# EAGLE design JTAG (EAGLE 7.5.0)
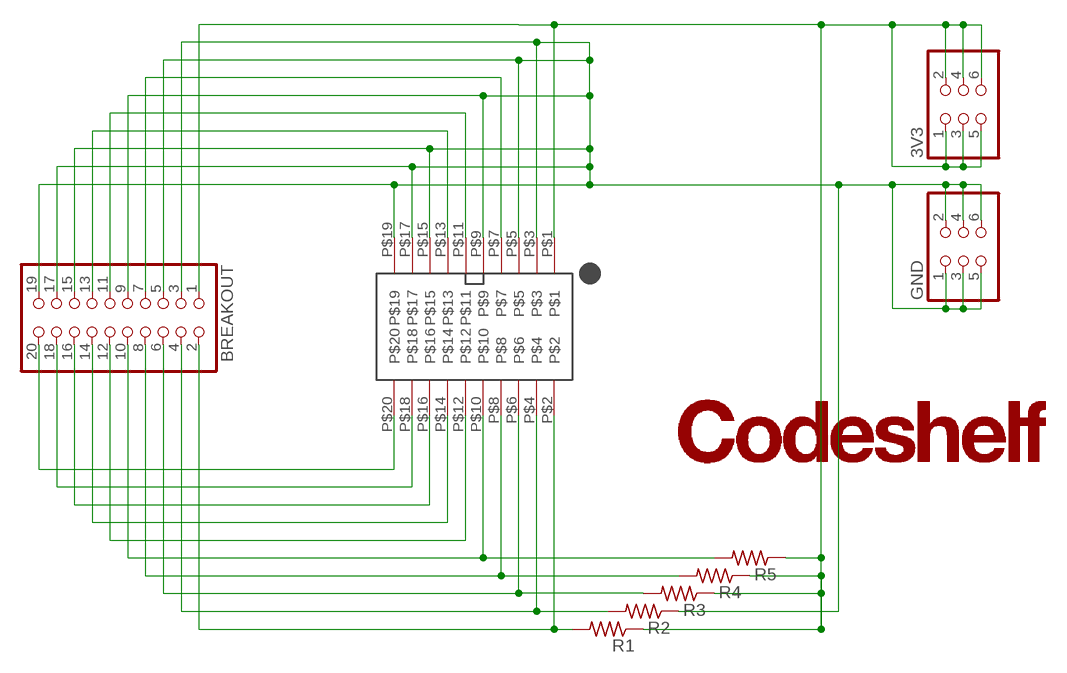
[diagram p0: schematic, sheet 1]

## Parts
3V3  PINHD-2X3  [2X03]
BREAKOUT  PINHD-2X10  [2X10]
GND  PINHD-2X3  [2X03]
JTAG  2X10JTAG  [2X10JTAG]
R1  R-US_0207/10  [0207/10]
R2  R-US_0207/10  [0207/10]
R3  R-US_0207/10  [0207/10]
R4  R-US_0207/10  [0207/10]
R5  R-US_0207/10  [0207/10]
U$1  CODESHELF-LOGOSMALL  [CODESHELF-LOGO-SMALL]

## Nets
3V3: 3V3.1 3V3.2 3V3.3 3V3.4 3V3.5 3V3.6 BREAKOUT.1 JTAG.P$1 R1.1 R3.1 R4.1 R5.1
GND: BREAKOUT.3 BREAKOUT.5 BREAKOUT.9 BREAKOUT.15 BREAKOUT.17 BREAKOUT.19 GND.1 GND.2 GND.3 GND.4 GND.5 GND.6 JTAG.P$3 JTAG.P$5 JTAG.P$9 JTAG.P$15 JTAG.P$17 JTAG.P$19 R2.1
N$2: BREAKOUT.2 JTAG.P$2 R1.2
N$3: BREAKOUT.4 JTAG.P$4 R2.2
N$4: BREAKOUT.6 JTAG.P$6 R3.2
N$5: BREAKOUT.8 JTAG.P$8 R4.2
N$6: BREAKOUT.10 JTAG.P$10 R5.2
N$7: BREAKOUT.12 JTAG.P$12
N$8: BREAKOUT.14 JTAG.P$14
N$9: BREAKOUT.16 JTAG.P$16
N$10: BREAKOUT.18 JTAG.P$18
N$11: BREAKOUT.20 JTAG.P$20
N$14: BREAKOUT.7 JTAG.P$7
N$16: BREAKOUT.11 JTAG.P$11
N$27: BREAKOUT.13 JTAG.P$13

## Library data of the parts
3V3 GND = pinhead:PINHD-2X3: PIN HEADER
BREAKOUT = pinhead:PINHD-2X10: PIN HEADER
JTAG = KW2:2X10JTAG; MFGN: CNC Tech; MFGP: 3220-20-0100-00
R1-R5 = resistor:R-US_: RESISTOR, American symbol
U$1 = GW-devices:CODESHELF-LOGO

## Board
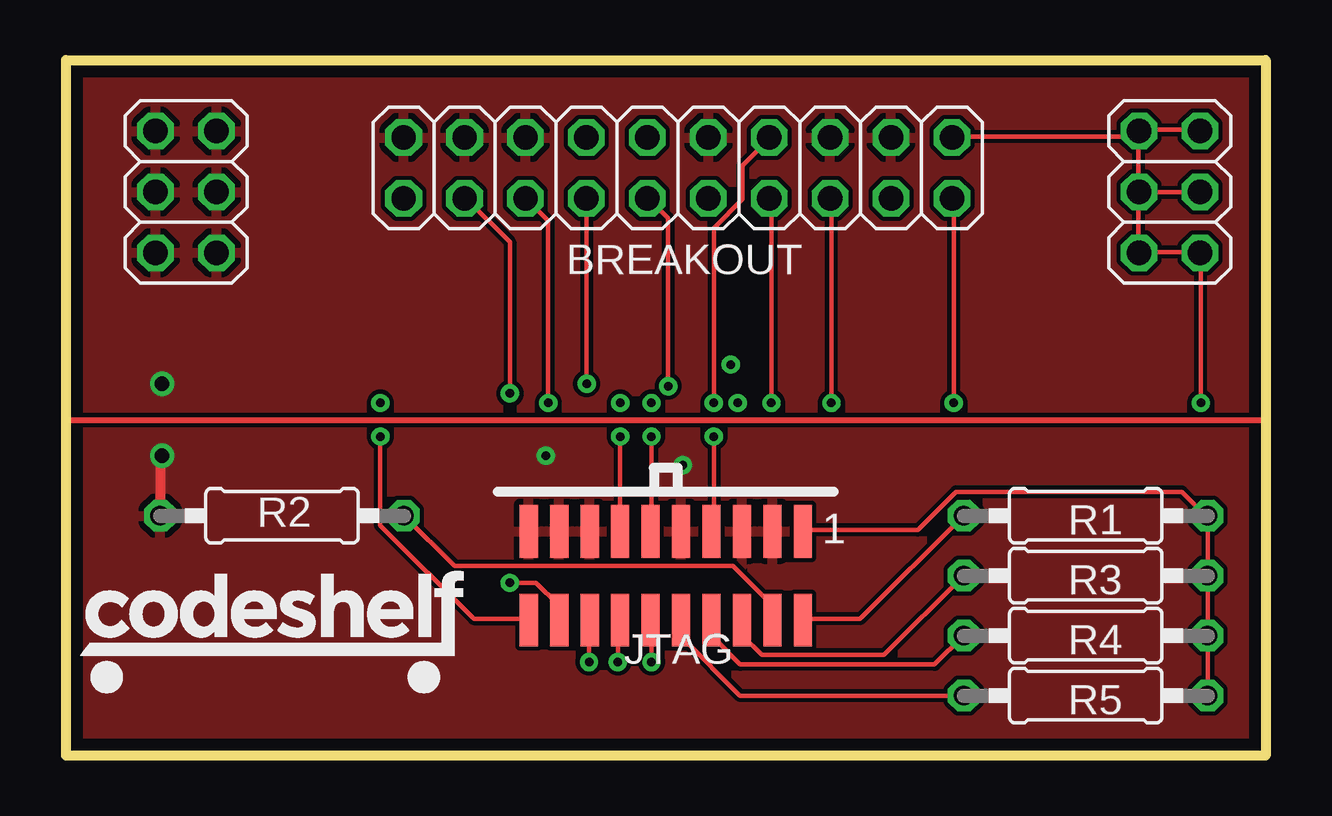
[diagram p1: board, top side]
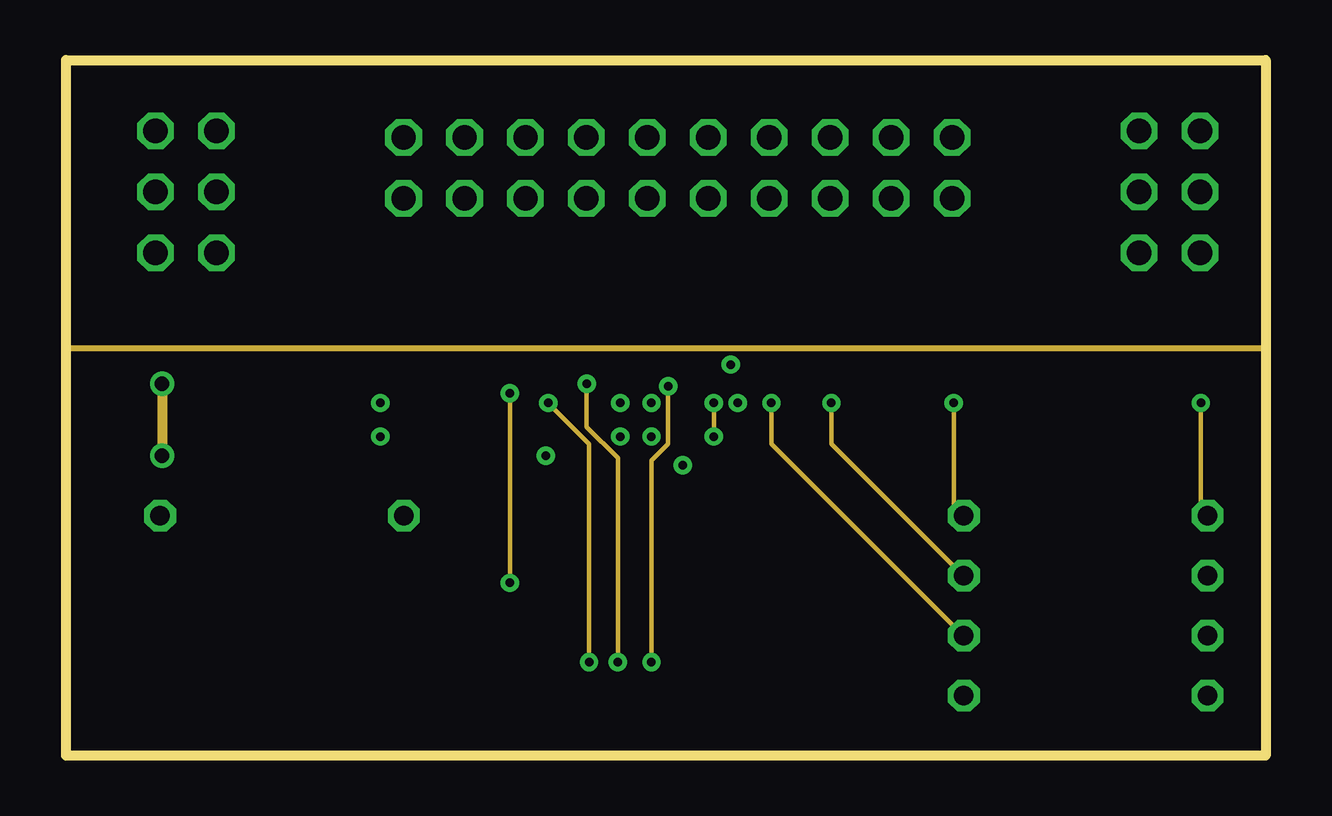
[diagram p2: board, inner layer Route2]
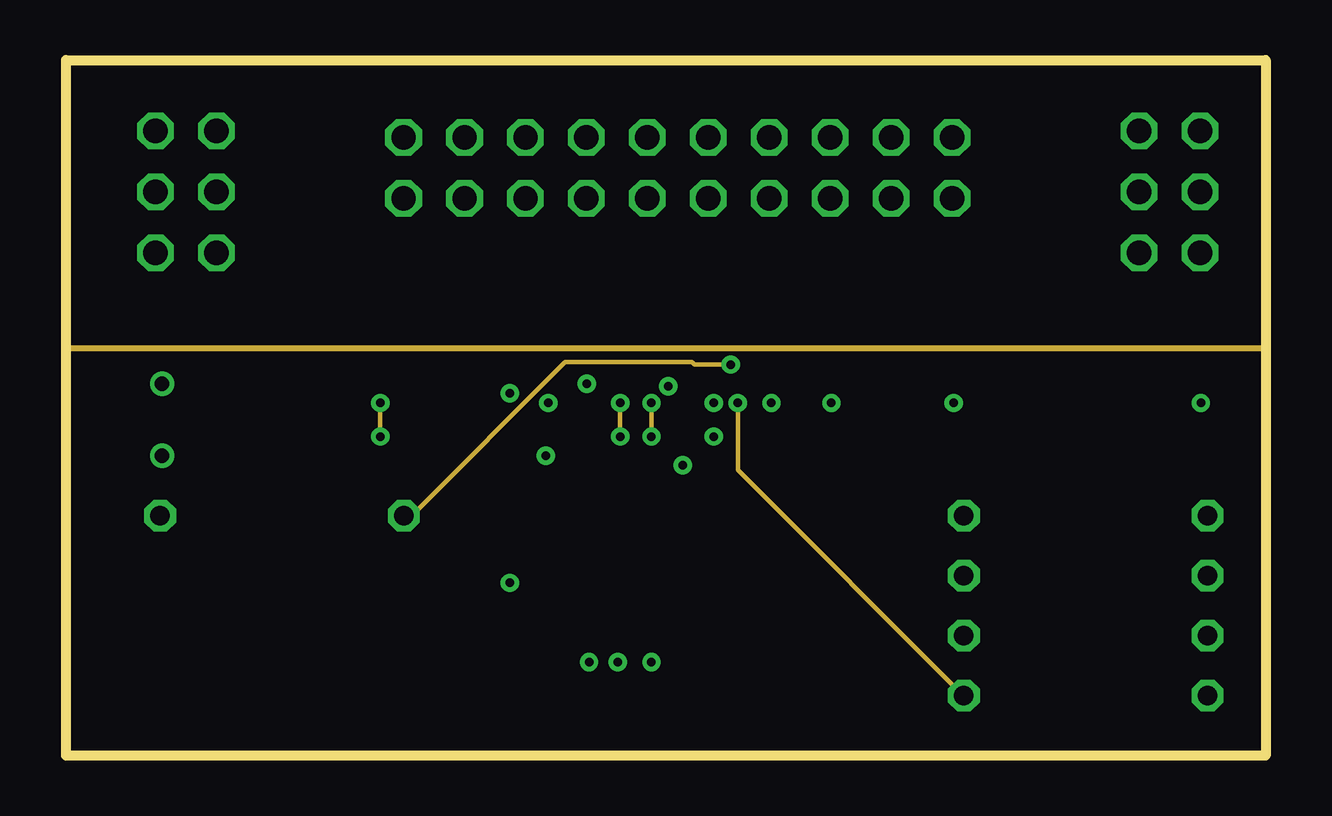
[diagram p3: board, inner layer Route15]
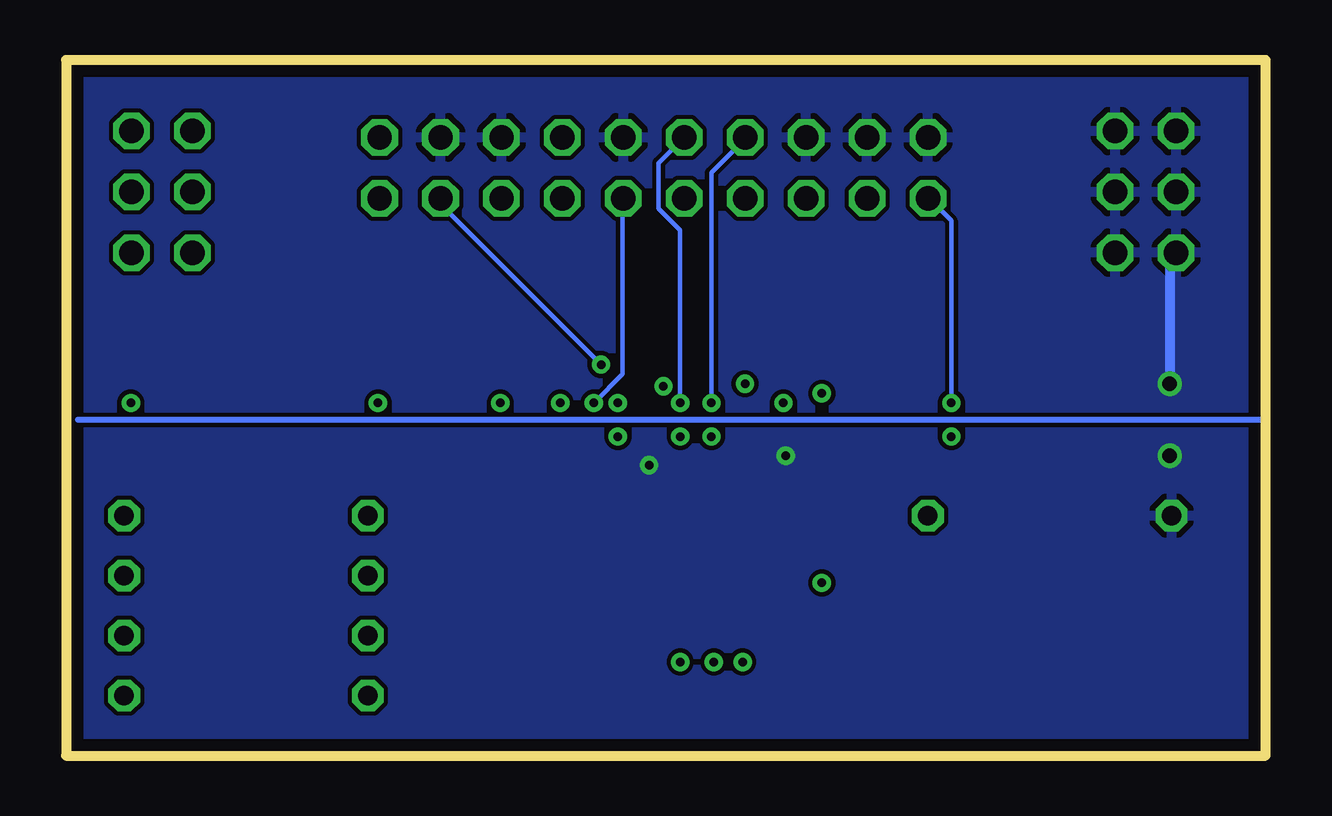
[diagram p4: board, bottom side, seen from below]

Size 50 x 29 mm. Coordinates in mm from the lower left corner, seen from the top.
Outline: 0,0 50,0
Outline: 50,0 50,29
Outline: 50,29 0,29
Outline: 0,29 0,0
Outline: 0,0 0,29
Outline: 0,29 50,29
Outline: 50,29 50,0
Outline: 50,0 0,0
Copper layers (1*2*15*16): Top 0.0356mm / dielectric 1.5011mm / Route2 0.0356mm / dielectric 0.1499mm / Route15 0.0356mm / dielectric 0.2007mm / Bottom 0.0356mm
Design rules "Codeshelf_Standard *": minimum track width 7mil, minimum drill 14mil, track to track 7mil, track to pad 7mil, pad to pad 7mil, via to via 7mil, smd to smd 0mil, copper to edge 20mil, drill to drill 8mil, minimum pad ring 10mil, minimum via ring 8mil, stop-mask expansion 4mil, vias tented up to drill 0mil, thermal gap 10mil

### Footprints (pad centres in the part's own frame; a part is rotated, then mirrored left to right if it is on the bottom)
2X03 = drill 1.016 octagon: 1 -2.54,-1.27; 2 -2.54,1.27; 3 0,-1.27; 4 0,1.27; 5 2.54,-1.27; 6 2.54,1.27
2X10 = drill 1.016 octagon: 1 -11.43,-1.27; 2 -11.43,1.27; 3 -8.89,-1.27; 4 -8.89,1.27; 5 -6.35,-1.27; 6 -6.35,1.27; 7 -3.81,-1.27; 8 -3.81,1.27; 9 -1.27,-1.27; 10 -1.27,1.27; 11 1.27,-1.27; 12 1.27,1.27; 13 3.81,-1.27; 14 3.81,1.27; 15 6.35,-1.27; 16 6.35,1.27; 17 8.89,-1.27; 18 8.89,1.27; 19 11.43,-1.27; 20 11.43,1.27
2X10JTAG-SMD = smd 0.76 x 2.2: P$1 -5.715,-1.85; P$2 -5.715,1.85; P$3 -4.445,-1.85; P$4 -4.445,1.85; P$5 -3.175,-1.85; P$6 -3.175,1.85; P$7 -1.905,-1.85; P$8 -1.905,1.85; P$9 -0.635,-1.85; P$10 -0.635,1.85; P$11 0.635,-1.85; P$12 0.635,1.85; P$13 1.905,-1.85; P$14 1.905,1.85; P$15 3.175,-1.85; P$16 3.175,1.85; P$17 4.445,-1.85; P$18 4.445,1.85; P$19 5.715,-1.85; P$20 5.715,1.85
0207/10 = drill 0.813 octagon: 1 -5.08,0; 2 5.08,0

### Placement (x,y rotation side)
3V3  46,23.5 90 top
BREAKOUT  25.5,24.5 180 top
GND  5,23.5 90 top
JTAG  2X10JTAGSMD  [2X10JTAG-SMD]  25,7.5 180 top
R1  42.5,10 180 top
R2  9,10 0 top
R3  42.5,7.5 180 top
R4  42.5,5 180 top
R5  42.5,2.5 180 top
U$1  0.5,2.5 0 top

### Tracks (layer width: path | path; a pad name or v marks a point on that pad's centre or on a via)
3V3  (via drill 0.36)
  Top 0.178: BREAKOUT.1 37,25.8 44.5,25.8 44.7,26 3V3.6 | 44.7,23.5 44.7,25.9 3V3.6 | 44.7,23.5 3V3.4 | 3V3.3 47.2,23.5 44.8,23.5 3V3.4 | 3V3.5 47.2,26.1 44.8,26.1 3V3.6 | 44.7,23.5 44.7,21 3V3.2 44.8,21 47.2,21 3V3.1 47.3,20.9 v47.3,14.7 | 44.7,23.5 3V3.4 | 47.6,5 47.6,2.5 R5.1 | 47.6,5 R4.1 47.6,5 | JTAG.P$1 30.8,9.4 35.5,9.4 37.1,11 46.5,11 47.5,10 R1.1 47.6,10 47.6,7.5 | 47.6,7.5 R3.1 47.6,7.5 | 47.6,7.5 47.6,5
  Route2 0.178: v47.3,14.7 47.3,10.2 47.5,10 R1.1
GND  (via drill 0.36, 0.6)
  Top 0.406: v4,12.5 3.92,12.5 R2.1
  Route2 0.406: v4,15.5 v4,12.5
  Bottom 0.406: GND.2 4,20.96 v4,15.5
  other vias: 20,12.5 25.7,12.1
  pour Top: 0,29 50,29 50,0 0,0
  pour Bottom: 0,29 50,29 50,0 0,0
N$1
  Top 0.254: 0,14 50,14
N$2  (via drill 0.36)
  Top 0.178: JTAG.P$2 30.8,5.7 33.1,5.7 37.4,10 R1.2 | v37,14.7 37,23.2 BREAKOUT.2
  Route2 0.178: v37,14.7 37,10.4 37.4,10 R1.2
N$3  (via drill 0.36)
  Top 0.178: JTAG.P$4 29.4,5.7 29.4,6.3 27.8,7.9 16.2,7.9 14.1,10 R2.2
  Route15 0.178: v27.7,16.3 26.2,16.3 26.1,16.4 20.8,16.4 14.4,10 14.1,10 R2.2
  Bottom 0.178: v27.7,16.3 34.3,22.9 34.3,23.2 BREAKOUT.4
N$4  (via drill 0.36)
  Top 0.178: JTAG.P$6 28.2,5.6 28.2,5 29,4.2 34.1,4.2 37.4,7.5 R3.2 | v31.9,14.7 31.9,23.2 BREAKOUT.6
  Route2 0.178: v31.9,14.7 31.9,13 37.4,7.5 R3.2
N$5  (via drill 0.36)
  Top 0.178: JTAG.P$8 27,5.6 27,4.9 28.1,3.8 36.2,3.8 37.4,5 R4.2 | v29.4,14.7 29.4,23.2 BREAKOUT.8
  Route2 0.178: v29.4,14.7 29.4,13 37.4,5 R4.2
N$6  (via drill 0.36)
  Top 0.178: JTAG.P$10 25.7,5.6 25.7,4.9 28.1,2.5 37.4,2.5 R5.2
  Route15 0.178: v28,14.7 28,11.9 37.4,2.5 R5.2
  Bottom 0.178: v28,14.7 26.8,15.9 26.8,23.2 BREAKOUT.10
N$7  (via drill 0.36)
  Top 0.178: v24.4,3.9 24.4,5.6 JTAG.P$12 | v25.1,15.4 25.1,22.4 24.3,23.2 BREAKOUT.12
  Route2 0.178: v24.4,3.9 24.4,12.3 25.1,13 v25.1,15.4
N$8  (via drill 0.36)
  Top 0.178: v23,3.9 23,5.6 JTAG.P$14 | v21.7,15.5 21.7,23.2 BREAKOUT.14
  Route2 0.178: v23,3.9 23,12.4 21.7,13.7 v21.7,15.5
N$9  (via drill 0.36)
  Top 0.178: v21.8,3.9 21.8,5.6 JTAG.P$16 | v20.1,14.7 20.1,22.3 19.2,23.2 BREAKOUT.16
  Route2 0.178: v21.8,3.9 21.8,13 v20.1,14.7
N$10  (via drill 0.36)
  Top 0.178: v18.5,7.2 19.6,7.2 20.5,6.3 20.5,5.7 JTAG.P$18 | v18.5,15.1 18.5,21.4 16.7,23.2 BREAKOUT.18
  Route2 0.178: v18.5,15.1 v18.5,7.2
N$11  (via drill 0.36)
  Top 0.178: v13.1,13.3 13.1,9.6 17,5.7 19.2,5.7 JTAG.P$20
  Route15 0.178: v13.1,14.7 v13.1,13.3
  Bottom 0.178: v13.1,14.7 13.1,22.3 14,23.2 BREAKOUT.20
N$12
  Bottom 0.254: 0,14 49.5,14
N$13
  Route15 0.254: 0,17 50,17
N$14  (via drill 0.36)
  Top 0.178: v27,13.3 27,9.4 JTAG.P$7 | v27,14.7 27,22 28.2,23.2 28.2,24.6 29.3,25.7 BREAKOUT.7
  Route2 0.178: v27,14.7 v27,13.3
N$15
  Route2 0.254: 0,17 50,17
N$16  (via drill 0.36)
  Top 0.178: v24.4,13.3 24.4,9.4 JTAG.P$11
  Route15 0.178: v24.4,14.7 v24.4,13.3
  Bottom 0.178: v24.4,14.7 24.4,21.9 25.3,22.8 25.3,24.7 24.3,25.7 BREAKOUT.11
N$27  (via drill 0.36)
  Top 0.178: v23.1,13.3 23.1,9.4 JTAG.P$13
  Route15 0.178: v23.1,14.7 v23.1,13.3
  Bottom 0.178: v23.1,14.7 23.1,24.3 21.7,25.7 BREAKOUT.13

### Text on the board
Document: This board routed badly to cause the use of extra vias and inner layers so that the shop can experiment with difficult 4-layer concepts.
255: GND | +3V3